# EAGLE design beaconboard2 (EAGLE 6.6.0)
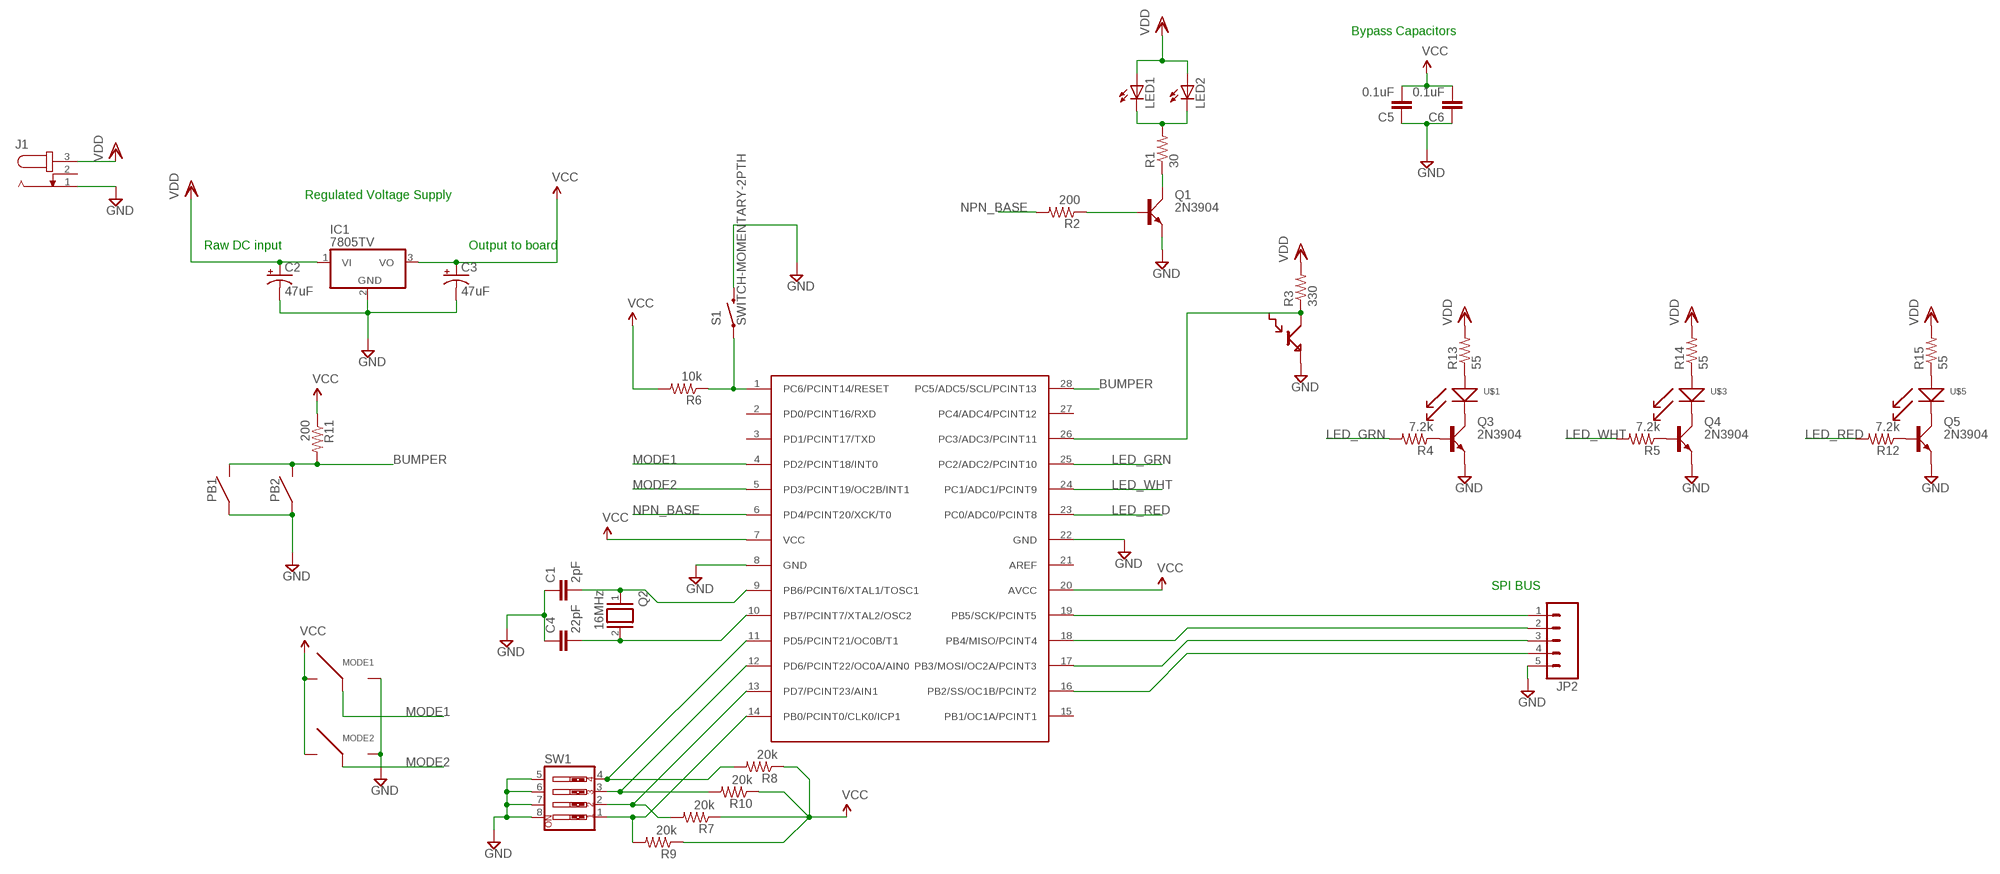
[diagram p0: schematic, sheet 1]

## Parts
C1  2pF  CAPPTH  [CAP-PTH-SMALL]
C2  47uF  CAP_POLPTH2  [CPOL-RADIAL-10UF-25V]
C3  47uF  CAP_POLPTH2  [CPOL-RADIAL-10UF-25V]
C4  22pF  CAPPTH  [CAP-PTH-SMALL]
C5  0.1uF  CAPPTH1  [CAP-PTH-5MM]
C6  0.1uF  CAPPTH1  [CAP-PTH-5MM]
IC1  7805TV  [TO220V]
J1  JACK-PLUG1  [SPC4078]
JP2  M05LOCK_LONGPADS  [1X05_LOCK_LONGPADS]
LED1  LED-2AC-CP41B-WES  [CP41B]
LED2  LED-2AC-CP41B-WES  [CP41B]
MODE1  SPD_SLIDE_SWITCH  [SPDT_SLIDE_SWITCH]
MODE2  SPD_SLIDE_SWITCH  [SPDT_SLIDE_SWITCH]
PB1  D6_PUSHBUTTON  [D6_PUSH_BUTTON]
PB2  D6_PUSHBUTTON  [D6_PUSH_BUTTON]
Q1  2N3904  [TO92D]
Q2  16MHz  XTAL/S  [QS]
Q3  2N3904  [TO92D]
Q4  2N3904  [TO92D]
Q5  2N3904  [TO92D]
R1  30  RESISTORPTH-1/4W  [AXIAL-0.4]
R2  200  RESISTORPTH-1/4W  [AXIAL-0.4]
R3  330  RESISTORPTH-1/4W  [AXIAL-0.4]
R4  7.2k  RESISTORPTH-1/4W  [AXIAL-0.4]
R5  7.2k  RESISTORPTH-1/4W  [AXIAL-0.4]
R6  10k  RESISTORPTH-1/4W  [AXIAL-0.4]
R7  20k  RESISTORPTH-1/4W  [AXIAL-0.4]
R8  20k  RESISTORPTH-1/4W  [AXIAL-0.4]
R9  20k  RESISTORPTH-1/4W  [AXIAL-0.4]
R10  20k  RESISTORPTH-1/4W  [AXIAL-0.4]
R11  200  RESISTORPTH-1/4W  [AXIAL-0.4]
R12  7.2k  RESISTORPTH-1/4W  [AXIAL-0.4]
R13  55  RESISTORPTH-1/4W  [AXIAL-0.4]
R14  55  RESISTORPTH-1/4W  [AXIAL-0.4]
R15  55  RESISTORPTH-1/4W  [AXIAL-0.4]
S1  SWITCH-MOMENTARY-2PTH  [TACTILE-PTH]
SW1  SW_DIP-4  [EDG-04]
U$1  8MM_LED  [8MM_LED]
U$2  BPW77NA  [TO-18]
U$3  8MM_LED  [8MM_LED]
U$4  ATMEGA328  [DIL28-3]
U$5  8MM_LED  [8MM_LED]

## Nets
BUMPER: PB1.3 PB1.4 PB2.3 PB2.4 R11.P$2 U$4.28(PC5/ADC5/SCL/PCINT13)
GND: C1.1 C2.2(-) C3.2(-) C4.1 C5.1 C6.1 IC1.2(GND) J1.1 JP2.5 MODE1.3 MODE2.3 PB1.1 PB1.2 PB2.1 PB2.2 Q1.E Q3.E Q4.E Q5.E S1.3 SW1.5 SW1.6 SW1.7 SW1.8 U$2.E U$4.8(GND) U$4.22(GND)
LED_GRN: R4.P$2 U$4.25(PC2/ADC2/PCINT10)
LED_RED: R12.P$2 U$4.23(PC0/ADC0/PCINT8)
LED_WHT: R5.P$2 U$4.24(PC1/ADC1/PCINT9)
MODE1: MODE1.2 U$4.4(PD2/PCINT18/INT0)
MODE2: MODE2.2 U$4.5(PD3/PCINT19/OC2B/INT1)
N$1: Q1.C R1.P$1
N$2: Q1.B R2.P$1
N$3: LED1.1(C) LED1.4(C) LED2.1(C) LED2.4(C) R1.P$2
N$4: Q3.B R4.P$1
N$5: JP2.1 U$4.19(PB5/SCK/PCINT5)
N$6: JP2.2 U$4.18(PB4/MISO/PCINT4)
N$7: JP2.3 U$4.17(PB3/MOSI/OC2A/PCINT3)
N$8: Q4.B R5.P$1
N$9: R3.P$1 U$2.C U$4.26(PC3/ADC3/PCINT11)
N$10: Q5.B R12.P$1
N$11: R6.P$1 S1.1 U$4.1(PC6/PCINT14/RESET)
N$12: C1.2 Q2.1 U$4.9(PB6/PCINT6/XTAL1/TOSC1)
N$13: C4.2 Q2.2 U$4.10(PB7/PCINT7/XTAL2/OSC2)
N$14: R7.P$2 SW1.2 U$4.13(PD7/PCINT23/AIN1)
N$15: R8.P$2 SW1.4 U$4.11(PD5/PCINT21/OC0B/T1)
N$16: R10.P$2 SW1.3 U$4.12(PD6/PCINT22/OC0A/AIN0)
N$17: Q3.C U$1.NEG
N$18: Q4.C U$3.NEG
N$19: R9.P$2 SW1.1 U$4.14(PB0/PCINT0/CLK0/ICP1)
N$20: JP2.4 U$4.16(PB2/SS/OC1B/PCINT2)
N$21: Q5.C U$5.NEG
N$22: R13.P$1 U$1.POS
N$23: R14.P$1 U$3.POS
N$24: R15.P$1 U$5.POS
NPN_BASE: R2.P$2 U$4.6(PD4/PCINT20/XCK/T0)
VCC: C3.1(+) C5.2 C6.2 IC1.3(VO) MODE1.1 MODE2.1 R6.P$2 R7.P$1 R8.P$1 R9.P$1 R10.P$1 R11.P$1 U$4.7(VCC) U$4.20(AVCC)
VDD: C2.1(+) IC1.1(VI) J1.3 LED1.2(A) LED1.3(A) LED2.2(A) LED2.3(A) R3.P$2 R13.P$2 R14.P$2 R15.P$2
Unconnected: J1.2 U$4.2(PD0/PCINT16/RXD) U$4.3(PD1/PCINT17/TXD) U$4.15(PB1/OC1A/PCINT1) U$4.21(AREF) U$4.27(PC4/ADC4/PCINT12)

## Notes on the sheet
- Bypass Capacitors
- Regulated Voltage Supply
- Raw DC input | Output to board
- SPI BUS

## Library data of the parts
C1 C4-C6 = SparkFun-Passives:CAP: Capacitor Standard 0603 ceramic capacitor, and 0.1" leaded capacitor.
C2 C3 = SparkFun-Capacitors:CAP_POL: Capacitor Polarized These are standard SMD and PTH capacitors. Normally 10uF, 47uF, and 100uF in electrolytic and tantalum varieties. Always verify the external diameter of the through hole cap, it varies with capacity, voltage, and manufacturer. The EIA devices should be standard.
IC1 = linear:78*: Positive VOLTAGE REGULATOR Source: http://cache.national.com/ds/LM/LM78L05.pdf http://www.fairchildsemi.com/ds/LM/LM7805.pdf
J1 = con-jack:JACK-PLUG: DC POWER JACK Power Jack, DC, Right Angle, Through Hole, Rated 5A at 16VDC, PC Terminals Distributor: Farnell (www.Farnell.de) Drawing: 84N1161.pdf / 84N1162.pdf Manufacturer: SPC Technology (www.spctechnology.com) Type: SPC4077 / SPC 4078; OC_FARNELL: unknown; OC_NEWARK: unknown
JP2 = SparkFun-Connectors:M05: Header 5 Standard 5-pin 0.1" header. Use with straight break away headers (SKU : PRT-00116), right angle break away headers (PRT-00553), swiss pins (PRT-00743), machine pins (PRT-00117), and female headers (PRT-00115). Molex polarized connector foot print use with SKU : PRT-08230 with associated crimp pins and housings.
LED1 LED2 = led:LED-2AC-: LEDs with 2 Cathode & 2 Anode - Kingbright SUPER FLUX LED LAMP Source: www.us.kingbright.com/images/catalog/SPEC/W7676CPBC-H.pdf Cree® P4 LED CP41B-WES/WGS Source: Data sheet <http://www.cree.com/products/pdf/LEDlamps/CP41B-WES&WGS.pdf>
MODE1 MODE2 = e11:SPD_SLIDE_SWITCH
PB1 PB2 = e11:D6_PUSHBUTTON
Q1 Q3-Q5 = transistor-small-signal:2N3904: NPN TRANSISTOR
Q2 = special:XTAL/S: CRYSTAL
R1-R15 = SparkFun-Resistors:RESISTOR: Resistor Basic schematic elements and footprints for 0603, 1206, and PTH resistors.
S1 = SparkFun-Electromechanical:SWITCH-MOMENTARY-2: Various NO switches- pushbuttons, reed, etc
SW1 = special:SW_DIP-4: DIP SWITCH
U$1 U$3 U$5 = e11:8MM_LED
U$2 = e11:BPW77NA
U$4 = hmcfabstudio:ATMEGA328: Atmega328 in a DIL28 package with pin names taken from the datasheet.

## Board
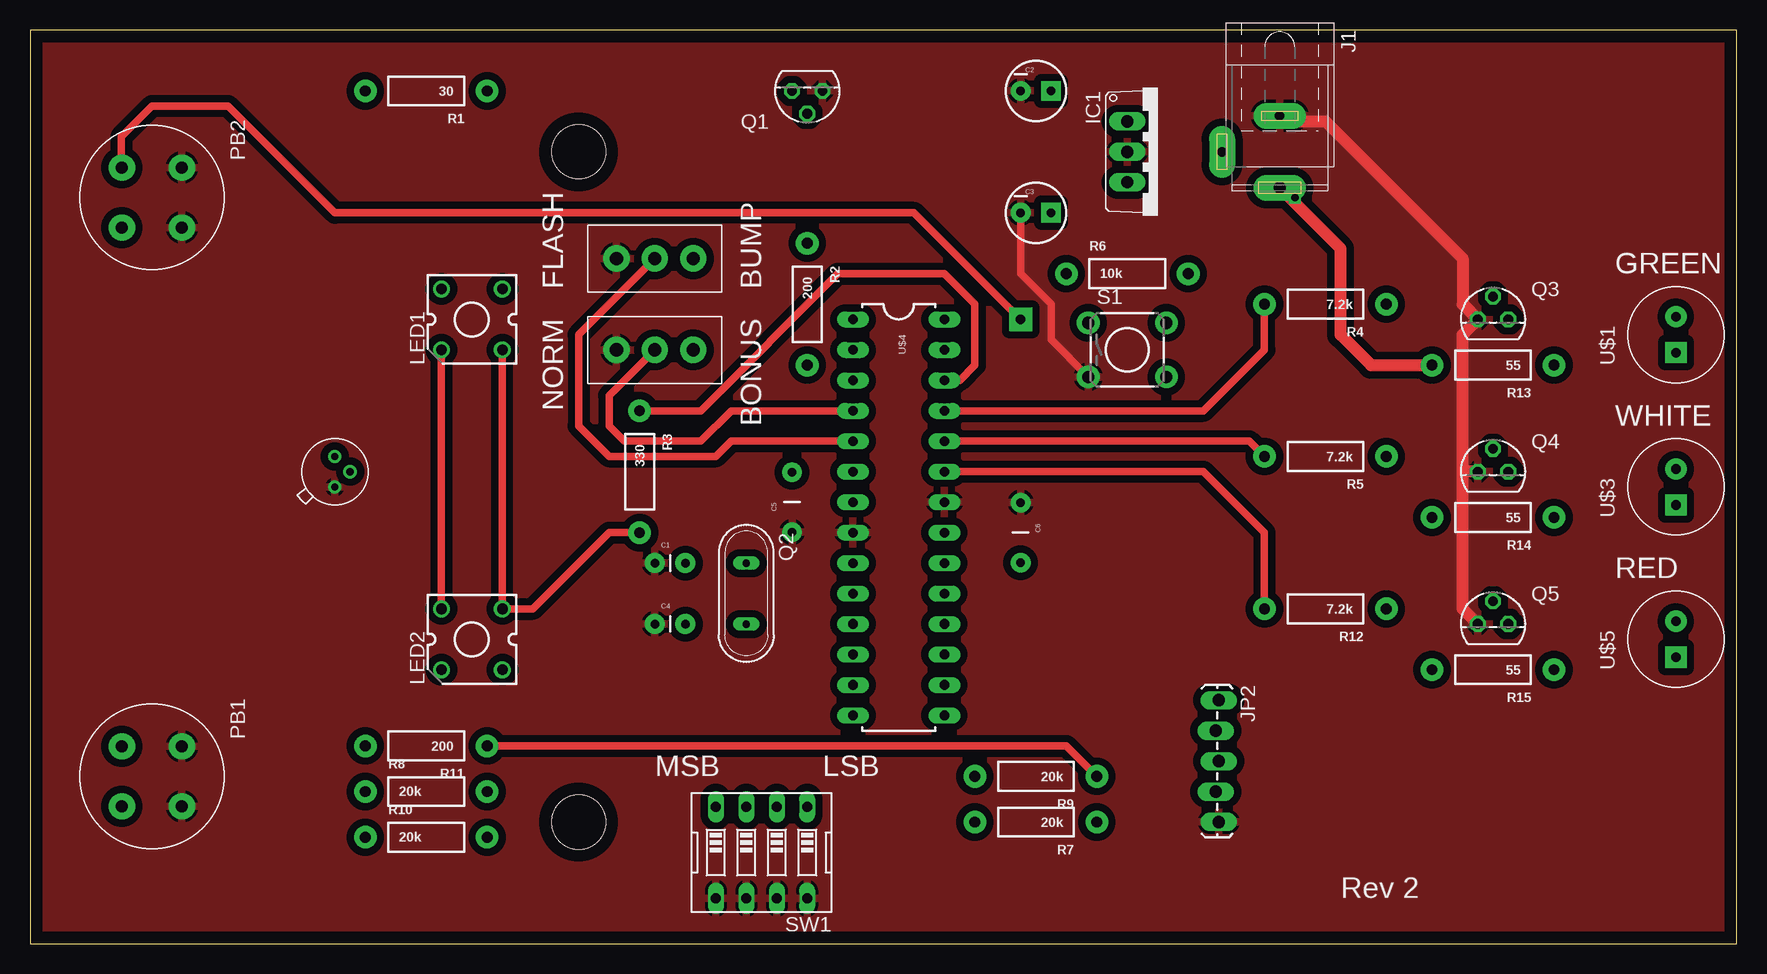
[diagram p1: board, top side]
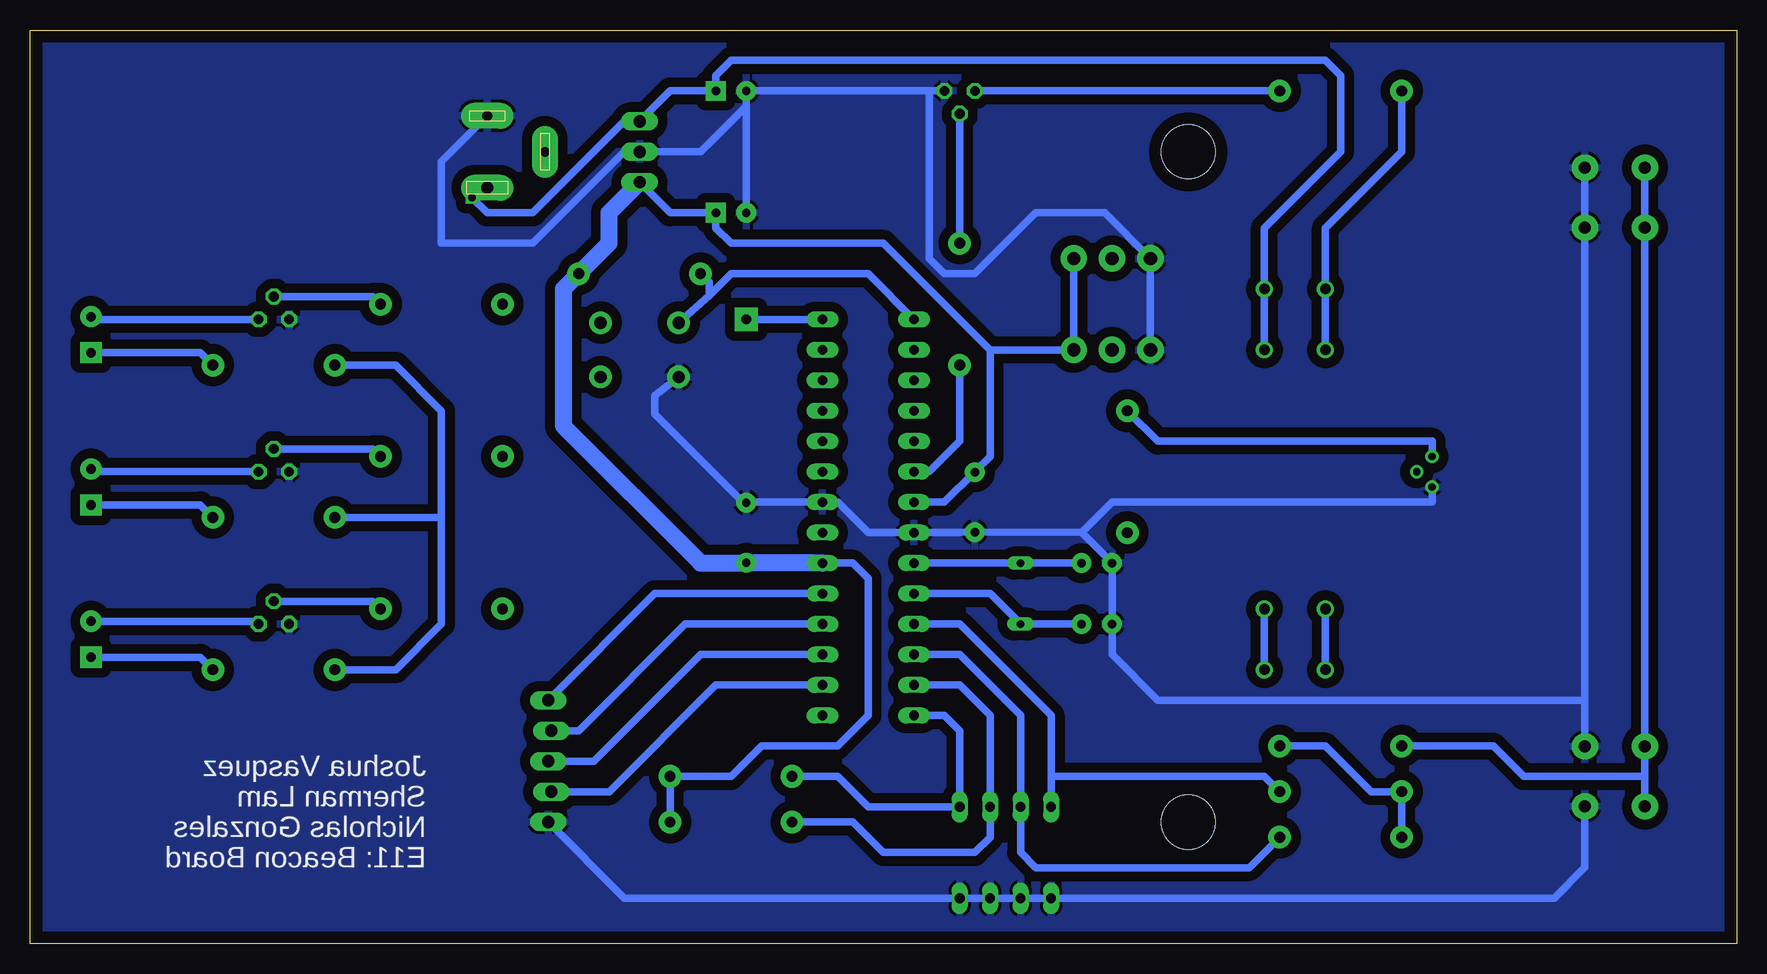
[diagram p2: board, bottom side, seen from below]

Size 142.24 x 76.2 mm. Coordinates in mm from the lower left corner, seen from the top.
Outline: 0,0 142.24,0 142.24,76.2 0,76.2 0,0
Copper layers (1*16): Top 0.035mm / dielectric 1.5mm / Bottom 0.035mm
Design rules "default": minimum track width 10mil, minimum drill 24mil, track to track 8mil, track to pad 8mil, pad to pad 8mil, via to via 8mil, smd to smd 8mil, copper to edge 40mil, drill to drill 8mil, minimum pad ring 10mil, minimum via ring 8mil, stop-mask expansion 4mil, vias tented up to drill 0mil, thermal gap 10mil
Holes 4.5 mm at 45.72,10.16 45.72,66.04

### Footprints (pad centres in the part's own frame; a part is rotated, then mirrored left to right if it is on the bottom)
CAP-PTH-SMALL = drill 0.7 pad 1.651: 1 0,0; 2 2.54,0
CPOL-RADIAL-10UF-25V = drill 0.7 pad 1.651 square: 1 1.27,0 | drill 0.7 pad 1.651: 2 -1.27,0
CAP-PTH-5MM = drill 0.7 pad 1.651: 1 -2.5,0; 2 2.5,0
TO220V = drill 1.016 long: 1 -2.54,-2.54; 2 0,-2.54; 3 2.54,-2.54
SPC4078 = drill 0.8 pad 2.184 long: 1 -3,0; 2 0,-4.8 | drill 1 pad 2.184 long: 3 3,0
1X05_LOCK_LONGPADS = drill 1.016 long: 1 0,0; 2 2.54,-0.254; 3 5.08,0; 4 7.62,-0.254; 5 10.16,0
CP41B = drill 0.9 pad 1.27: 1 -2.54,2.54; 2 -2.54,-2.54; 3 2.54,-2.54; 4 2.54,2.54
SPDT_SLIDE_SWITCH = drill 1.1 pad 2.184: 1 -3.2,0; 2 0,0; 3 3.2,0
D6_PUSH_BUTTON = drill 1 pad 2.184: 1 -2.5,2.5; 2 2.5,2.5; 3 -2.5,-2.5; 4 2.5,-2.5
TO92D = drill 0.813 octagon: B 0,1.905; C 1.27,0; E -1.27,0
QS = drill 0.61 long: 1 -2.54,0; 2 2.54,0
AXIAL-0.4 = drill 0.9 pad 1.88: P$1 -5.08,0; P$2 5.08,0
TACTILE-PTH = drill 1.016 pad 1.88: 1 -3.251,2.261; 2 3.251,2.261; 3 -3.251,-2.261; 4 3.251,-2.261
EDG-04 = drill 0.813 long: 1 -3.81,-3.81; 2 -1.27,-3.81; 3 1.27,-3.81; 4 3.81,-3.81; 5 3.81,3.81; 6 1.27,3.81; 7 -1.27,3.81; 8 -3.81,3.81
8MM_LED = drill 0.8 pad 1.778: NEG 1.5,0 | drill 0.8 pad 1.778 square: POS -1.5,0
TO-18 = drill 0.6: B 0,-1.27; C 1.27,0; E -1.27,0
DIL28-3 = drill 0.813 long: 1 -16.51,-3.81; 2 -13.97,-3.81; 3 -11.43,-3.81; 4 -8.89,-3.81; 5 -6.35,-3.81; 6 -3.81,-3.81; 7 -1.27,-3.81; 8 1.27,-3.81; 9 3.81,-3.81; 10 6.35,-3.81; 11 8.89,-3.81; 12 11.43,-3.81; 13 13.97,-3.81; 14 16.51,-3.81; 15 16.51,3.81; 16 13.97,3.81; 17 11.43,3.81; 18 8.89,3.81; 19 6.35,3.81; 20 3.81,3.81; 21 1.27,3.81; 22 -1.27,3.81; 23 -3.81,3.81; 24 -6.35,3.81; 25 -8.89,3.81; 26 -11.43,3.81; 27 -13.97,3.81; 28 -16.51,3.81

### Placement (x,y rotation side)
C1  52.07,31.75 0 top
C2  83.82,71.12 0 top
C3  83.82,60.96 0 top
C4  52.07,26.67 0 top
C5  63.5,36.83 90 top
C6  82.55,34.29 270 top
IC1  93.98,66.04 270 top
J1  104.14,66.04 270 top
JP2  99.06,20.32 270 top
LED1  36.83,52.07 90 top
LED2  36.83,25.4 90 top
MODE1  52.07,49.53 180 top
MODE2  52.07,57.15 180 top
PB1  10.16,13.97 270 top
PB2  10.16,62.23 270 top
Q1  64.77,71.12 180 top
Q2  59.69,29.21 270 top
Q3  121.92,52.07 0 top
Q4  121.92,39.37 0 top
Q5  121.92,26.67 0 top
R1  33.02,71.12 180 top
R2  64.77,53.34 270 top
R3  50.8,39.37 270 top
R4  107.95,53.34 180 top
R5  107.95,40.64 180 top
R6  91.44,55.88 0 top
R7  83.82,10.16 180 top
R8  33.02,12.7 0 top
R9  83.82,13.97 180 top
R10  33.02,8.89 0 top
R11  33.02,16.51 180 top
R12  107.95,27.94 180 top
R13  121.92,48.26 180 top
R14  121.92,35.56 180 top
R15  121.92,22.86 180 top
S1  91.44,49.53 0 top
SW1  60.96,7.62 180 top
U$1  137.16,50.8 90 top
U$2  25.4,39.37 90 top
U$3  137.16,38.1 90 top
U$4  72.39,35.56 270 top
U$5  137.16,25.4 90 top

### Tracks (layer width: path | path; a pad name or v marks a point on that pad's centre or on a via)
BUMPER  (via drill 0.8 pad 1.93)
  Top 0.61: v82.55,52.07 73.66,60.96 25.4,60.96 16.51,69.85 10.16,69.85 7.62,67.31 7.62,64.77 PB2.3
  Bottom 0.61: U$4.28 v82.55,52.07 | PB1.4 7.66,13.97 | 7.66,13.97 PB1.3 PB2.4 PB2.3 | R11.P$2 20.32,16.51 17.78,13.97 7.66,13.97
GND
  Top 0.61: C3.2 82.55,55.88 85.09,53.34 85.09,50.37 S1.3
  Top 1.016: Q5.E 119.38,27.94 119.38,39.37 | 119.38,39.37 119.38,50.8 Q3.E 119.38,53.34 119.38,57.15 107.95,68.58 104.6,68.58 J1.1 | Q4.E 119.38,39.37
  Bottom 0.61: S1.3 90.17,45.72 90.17,44.17 82.83,36.83 82.55,36.83 | 82.55,36.83 U$4.22 74.93,36.83 72.39,34.29 U$4.8 64.77,34.29 C5.1 54.61,34.29 | C6.1 82.55,36.83 | 54.61,34.29 C1.1 C4.1 52.07,24.13 48.26,20.32 12.66,20.32 | J1.1 107.95,65.23 107.95,58.42 100.33,58.42 92.71,66.04 IC1.2 86.36,66.04 82.55,69.85 | PB1.2 12.66,6.39 15.24,3.81 SW1.5 SW1.6 SW1.7 SW1.8 92.71,3.81 JP2.5 | PB1.1 12.66,20.32 | 12.66,20.32 PB2.2 PB2.1 | 54.61,34.29 52.07,36.83 25.4,36.83 U$2.E | MODE1.3 MODE2.3 52.68,60.96 58.42,60.96 63.5,55.88 66.04,55.88 67.31,57.15 67.31,71.12 | 82.55,69.85 C2.2 67.31,71.12 | C3.2 82.55,69.85 | Q1.E 67.31,71.12
  pour Bottom (isolate 0.813): 0,76.2 146.05,76.2 146.05,0 0,0
  pour Top (isolate 0.61): 0,76.2 0,0 144.78,0 144.78,76.2
LED_GRN
  Top 0.61: U$4.25 97.79,44.45 102.87,49.53 R4.P$2
LED_RED
  Top 0.61: U$4.23 97.79,39.37 102.87,34.29 R12.P$2
LED_WHT
  Top 0.61: U$4.24 101.6,41.91 R5.P$2
MODE1
  Top 0.61: MODE1.2 48.26,45.72 48.26,43.18 49.53,41.91 55.88,41.91 58.42,44.45 U$4.4
MODE2
  Top 0.61: MODE2.2 45.72,50.8 45.72,43.18 48.26,40.64 57.15,40.64 58.42,41.91 U$4.5
N$1
  Bottom 0.61: Q1.C R1.P$1
N$2
  Bottom 0.61: R2.P$1 Q1.B
N$3
  Top 0.61: LED1.1 LED2.4
  Bottom 0.61: LED1.1 LED1.4 34.29,59.69 27.94,66.04 R1.P$2 | LED2.4 LED2.1
N$4
  Bottom 0.61: Q3.B 113.67,53.98 R4.P$1
N$5
  Bottom 0.61: JP2.1 90.17,29.21 U$4.19
N$6
  Bottom 0.61: U$4.18 87.63,26.67 96.52,17.78 JP2.2
N$7
  Bottom 0.61: U$4.17 86.36,24.13 95.25,15.24 JP2.3
N$8
  Bottom 0.61: Q4.B 113.67,41.27 R5.P$1
N$9
  Top 0.61: R3.P$1 55.88,44.45 67.31,55.88 76.2,55.88 78.74,53.34 78.74,48.26 77.47,46.99 U$4.26
  Bottom 0.61: U$2.C 25.4,41.91 48.26,41.91 R3.P$1
N$10
  Bottom 0.61: Q5.B 113.67,28.57 R12.P$1
N$11
  Bottom 0.61: R6.P$1 85.65,55.17 85.65,54.05 | S1.1 85.65,54.05 | 85.65,54.05 83.82,55.88 72.39,55.88 U$4.1
N$12
  Bottom 0.61: U$4.9 Q2.1 C1.2
N$13
  Bottom 0.61: U$4.10 62.23,29.21 Q2.2 C4.2
N$14
  Bottom 0.61: U$4.13 64.77,21.59 62.23,19.05 SW1.2 62.23,8.89 63.5,7.62 71.12,7.62 73.66,10.16 R7.P$2
N$15
  Bottom 0.61: U$4.11 64.77,26.67 57.15,19.05 57.15,13.97 | 57.15,13.97 SW1.4 | R8.P$2 39.37,13.97 57.15,13.97
N$16
  Bottom 0.61: U$4.12 64.77,24.13 59.69,19.05 SW1.3 59.69,7.62 58.42,6.35 40.64,6.35 R10.P$2
N$17
  Bottom 0.61: Q3.C 136.93,52.07 U$1.NEG
N$18
  Bottom 0.61: Q4.C 136.93,39.37 U$3.NEG
N$19
  Bottom 0.61: U$4.14 66.04,19.05 64.77,17.78 SW1.1 72.39,11.43 74.93,13.97 R9.P$2
N$20
  Bottom 0.61: U$4.16 85.09,21.59 93.98,12.7 JP2.4
N$21
  Bottom 0.61: U$5.NEG 123.42,26.9 Q5.C
N$22
  Bottom 0.61: U$1.POS 128.04,49.3 R13.P$1
N$23
  Bottom 0.61: U$3.POS 128.04,36.6 R14.P$1
N$24
  Bottom 0.61: U$5.POS 128.04,23.9 R15.P$1
NPN_BASE
  Bottom 0.61: R2.P$2 64.77,41.91 67.31,39.37 U$4.6
VCC
  Top 0.61: R11.P$1 86.36,16.51 R9.P$1
  Bottom 0.61: IC1.3 88.9,60.96 C3.1 85.09,59.69 83.82,58.42 71.12,58.42 62.23,49.53 | R7.P$1 R9.P$1 83.82,13.97 81.28,16.51 74.93,16.51 72.39,19.05 72.39,30.48 73.66,31.75 U$4.20 | U$4.7 66.04,36.83 C5.2 63.5,39.37 62.23,40.64 62.23,49.53 | MODE2.1 MODE1.1 62.23,49.53 | R10.P$1 R8.P$1 30.48,12.7 34.29,16.51 R11.P$1
  Bottom 1.422: IC1.3 93.98,60.96 93.98,58.42 R6.P$2 97.79,54.61 97.79,43.18 86.36,31.75 82.59,31.75 C6.2 76.24,31.79 U$4.20
VDD  (via drill 0.6)
  Top 0.61: LED1.2 LED2.3 41.91,27.94 48.26,34.29 R3.P$2
  Top 1.016: R13.P$2 111.76,48.26 109.22,50.8 109.22,57.96 J1.3
  Bottom 0.61: J1.3 v105.41,62.23 104.14,60.96 100.33,60.96 92.71,68.58 IC1.1 88.9,71.12 C2.1 85.09,72.39 83.82,73.66 34.29,73.66 33.02,72.39 33.02,66.04 39.37,59.69 LED1.3 LED1.2 | LED2.2 LED2.3 | R13.P$2 111.76,48.26 107.95,44.45 107.95,35.56 | 107.95,35.56 107.95,26.67 111.76,22.86 R15.P$2 | R14.P$2 107.95,35.56

### Text on the board
tPlace: FLASH | BUMP | NORM | BONUS
tNames: GREEN | WHITE | RED | MSB | LSB
_tsilk: Rev 2
_bsilk: Joshua Vasquez | Sherman Lam | Nicholas Gonzales | E11: Beacon Board